# EAGLE board Longboard (EAGLE 9.1.3)
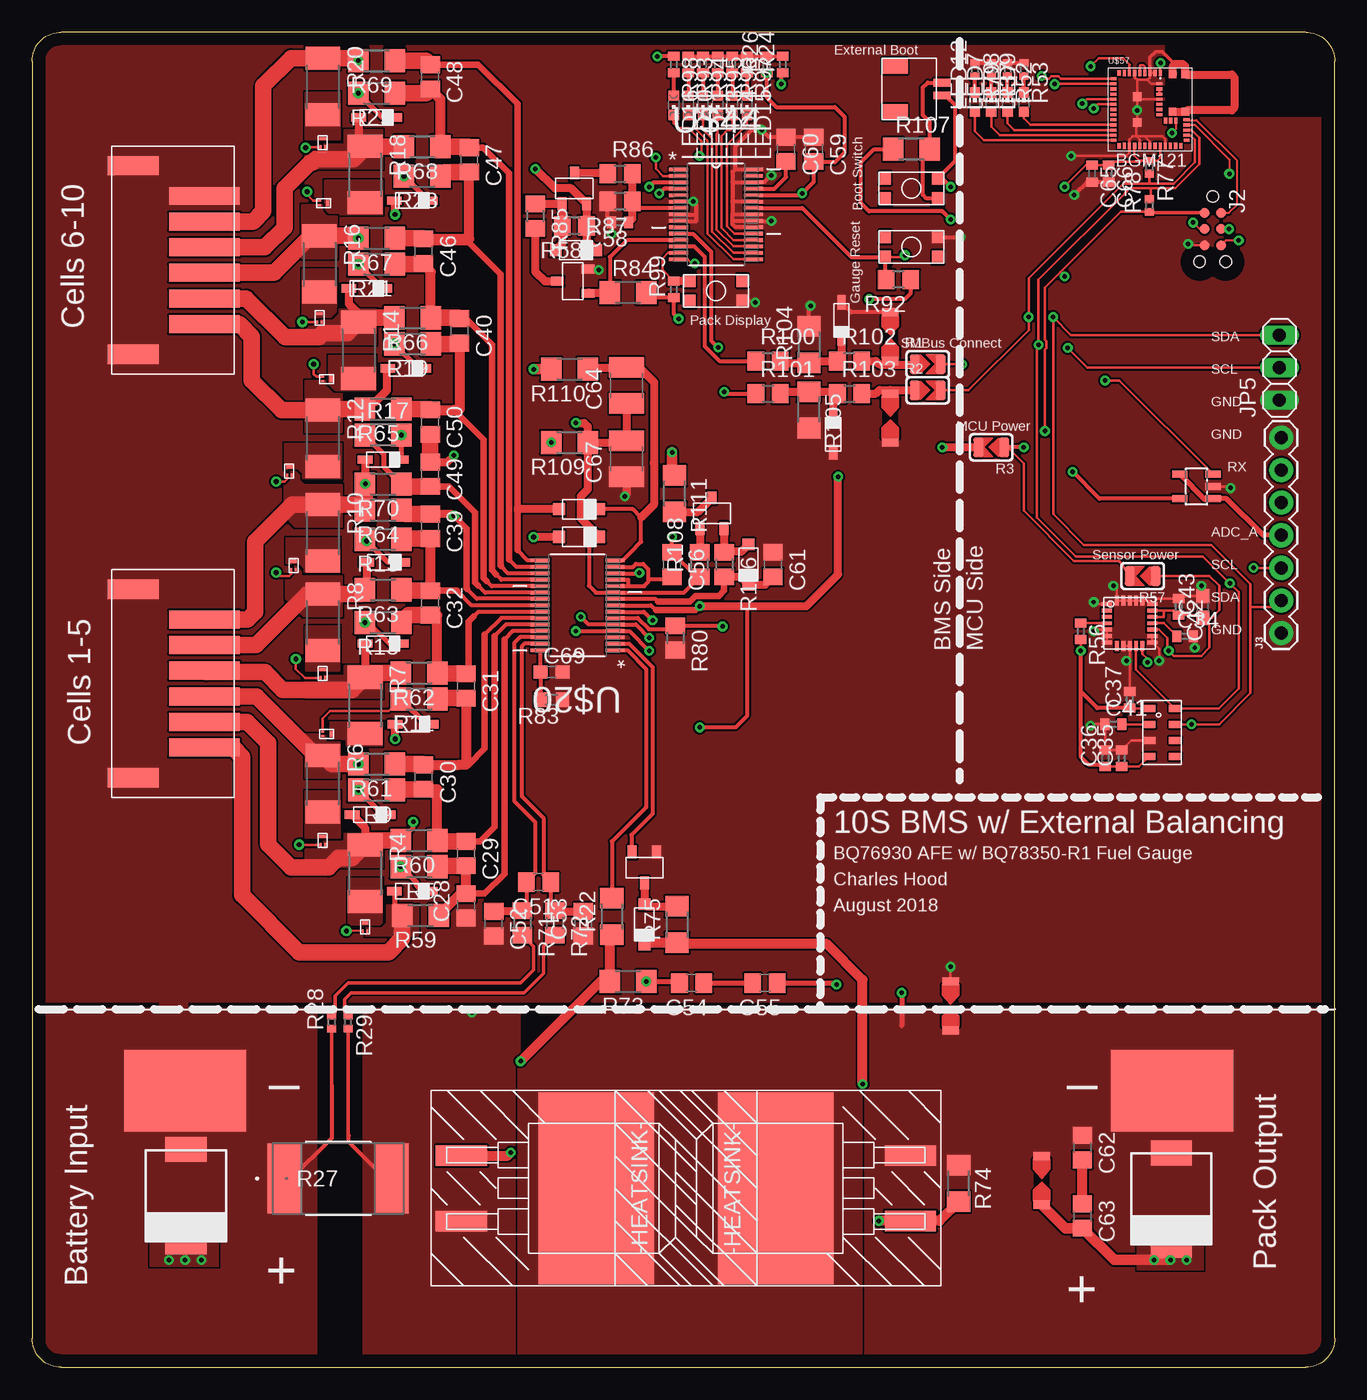
[diagram p4: board, top side]
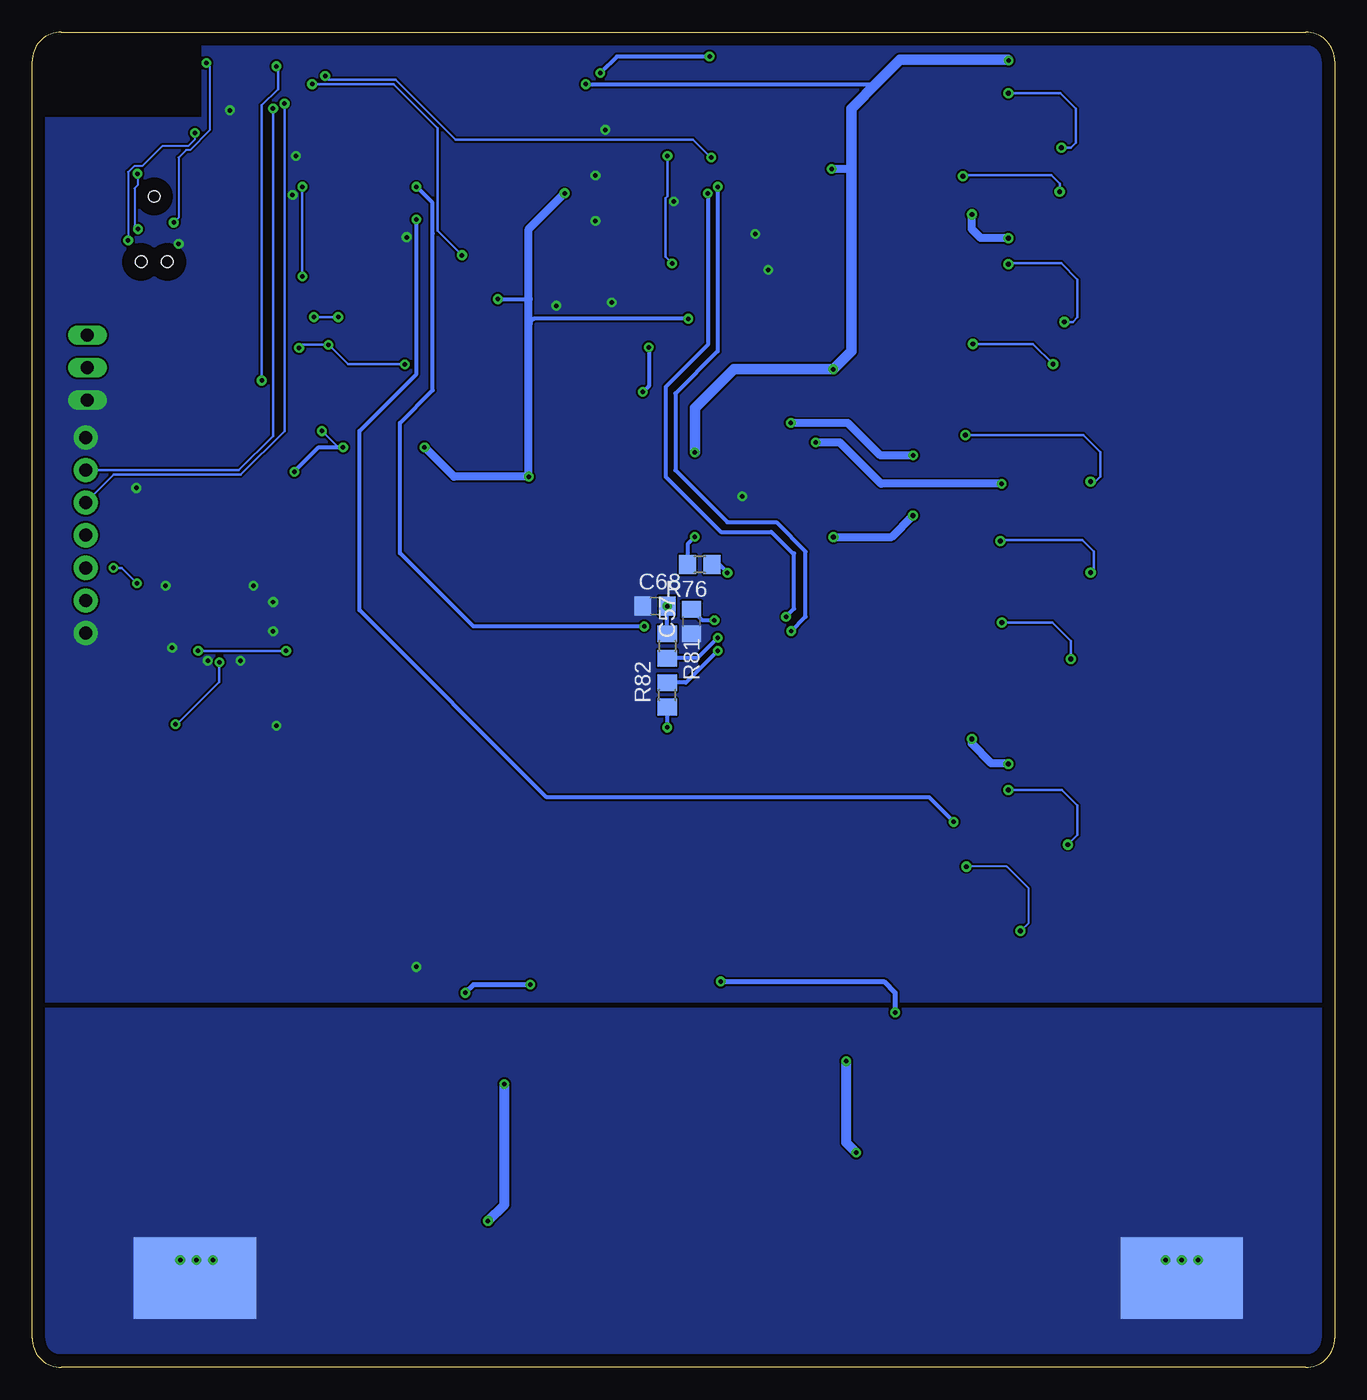
[diagram p5: board, bottom side, seen from below]

Size 101.6 x 104.14 mm. Coordinates in mm from the lower left corner, seen from the top.
Outline: 2.29,0 99.31,0 arc90 101.6,2.29 101.6,101.85 arc90 99.31,104.14 2.29,104.14 arc90 0,101.85 0,2.29 arc90 2.29,0
Copper layers (1*16): Top 0.035mm / dielectric 1.5mm / Bottom 0.035mm
Design rules "default": minimum track width 6mil, minimum drill 0.35mm, track to track 6mil, track to pad 6mil, pad to pad 6mil, via to via 6mil, smd to smd 6mil, copper to edge 40mil, drill to drill 6mil, minimum pad ring 10mil, minimum via ring 8mil, stop-mask expansion 4mil, vias tented up to drill 0mil, thermal gap 10mil
Net classes: 0 default: width 0.152 mm, drill 0.305 mm, clearance 0.152 mm; 1 power: width 0.203 mm, drill 0.305 mm, clearance 0.152 mm
tRestrict: area 88.4,97.5 to 101.6,105.4
bRestrict: area 88.4,97.5 to 102.4,105.2

## Footprints (pad centres in the part's own frame; a part is rotated, then mirrored left to right if it is on the bottom)
C0805 = smd 1.3 x 1.5: 1 -0.95,0; 2 0.95,0
C0402 = smd 0.7 x 0.9: 1 -0.65,0; 2 0.65,0
C0603 = smd 1.1 x 1: 1 -0.85,0; 2 0.85,0
C1210 = smd 1.6 x 2.7: 1 -1.4,0; 2 1.4,0
JST_2PIN_SH = smd 0.6 x 1.35: 1 -0.5,2.135; 2 0.5,2.135 | smd 1.2 x 2: A1 -1.8,-1.54; A2 1.8,-1.54
TC2030-MCP-NL = smd 0.787 x 0.787: 1 1.27,-0.635; 2 1.27,0.635; 3 2.54,-0.635; 4 2.54,0.635; 5 3.81,-0.635; 6 3.81,0.635 | hole 0.889: 0,0; 5.08,-1.016; 5.08,1.016
1X07 = drill 1.016 pad 1.88: 1 0,0; 2 2.54,0; 3 5.08,0; 4 7.62,0; 5 10.16,0; 6 12.7,0; 7 15.24,0
1X03 = drill 1.016 long: 1 -2.54,0; 2 0,0; 3 2.54,0
CHIP-LED0603 = smd 0.8 x 0.8: A 0,-0.75; C 0,0.75
CHIPLED_0603 = smd 0.8 x 0.8: A 0,-0.75; C 0,0.75
3-XFDFN = smd 0.5 x 0.25: P$1 0,0.325 | smd 0.15 x 0.25: P$2 -0.175,-0.325; P$3 0.175,-0.325
SOLDERJUMPER_ARROW_NOPASTE = smd 0.762 x 1.524: 1 -1.016,0; 2 1.016,0
R2010 = smd 1.8 x 2.7: 1 -2.2,0; 2 2.2,0
R1206 = smd 1.6 x 1.803: 1 -1.422,0; 2 1.422,0
R0402 = smd 0.7 x 0.9: 1 -0.65,0; 2 0.65,0
W-3921 = smd 2.642 x 5.461: 1 -4.166,0; 2 4.166,0
R0402' = smd 0.6 x 0.7: 1 -0.5,0; 2 0.5,0
R0805 = smd 1.3 x 1.5: 1 -0.95,0; 2 0.95,0
R0603 = smd 1 x 1.1: 1 -0.85,0; 2 0.85,0
KMR731NG = smd 0.9 x 1: P$1 -2.05,0.8; P$2 2.05,0.8; P$3 2.05,-0.8; P$4 -2.05,-0.8
SOD-323F = smd 0.65 x 1.15: 1 0,1.4; 2 0,-1.4
SOT23-5L = smd 0.55 x 1.2: 1 -0.95,-1.3; 2 0,-1.3; 3 0.95,-1.3; 4 0.95,1.3; 5 -0.95,1.3
PAD = smd 9.525 x 6.35: P$1 0,0
JST_6PIN = smd 1.4 x 5.5: 1 -5,-2.775; 2 -3,-2.775; 3 -1,-2.775; 4 1,-2.775; 5 3,-2.775; 6 5,-2.775 | smd 1.5 x 4: A1 -7.35,2.775; A2 7.35,2.775
SOIC-30 = smd 1.473 x 0.279: 1 -2.921,3.505; 2 -2.921,2.997; 3 -2.921,2.489; 4 -2.921,2.007; 5 -2.921,1.499; 6 -2.921,0.991; 7 -2.921,0.508; 8 -2.921,0; 9 -2.921,-0.508; 10 -2.921,-0.991; 11 -2.921,-1.499; 12 -2.921,-2.007; 13 -2.921,-2.489; 14 -2.921,-2.997; 15 -2.921,-3.505; 16 2.921,-3.505; 17 2.921,-2.997; 18 2.921,-2.489; 19 2.921,-2.007; 20 2.921,-1.499; 21 2.921,-0.991; 22 2.921,-0.508; 23 2.921,0; 24 2.921,0.508; 25 2.921,0.991; 26 2.921,1.499; 27 2.921,2.007; 28 2.921,2.489; 29 2.921,2.997; 30 2.921,3.505
SOD-123 = smd 0.9 x 0.95: P$1 -1.575,0; P$2 1.575,0
TO-263 = smd 1.6 x 4: 1 -2.54,-5.25; 2 2.54,-5.25 | smd 15 x 9: 3 0,5.25
MLP3115A2 = smd 0.95 x 0.55: 1 -1,1.875; 2 -1,0.625; 3 -1,-0.625; 4 -1,-1.875; 5 1,-1.875; 6 1,-0.625; 7 1,0.625; 8 1,1.875
FXAS21002 = smd 0.8 x 0.3: 1 -1.775,1.5; 2 -1.775,1; 3 -1.775,0.5; 4 -1.775,0; 5 -1.775,-0.5; 6 -1.775,-1; 7 -1.775,-1.5; 13 1.775,-1.5; 14 1.775,-1; 15 1.775,-0.5; 16 1.775,0; 17 1.775,0.5; 18 1.775,1; 19 1.775,1.5 | smd 0.3 x 0.8: 8 -1,-1.775; 9 -0.5,-1.775; 10 0,-1.775; 11 0.5,-1.775; 12 1,-1.775; 20 1,1.775; 21 0.5,1.775; 22 0,1.775; 23 -0.5,1.775; 24 -1,1.775
SOT23-3 = smd 0.7 x 1: 1 -0.95,-1.2; 2 0.95,-1.2; 3 0,1.2
SPARK_GAP = smd 1.27 x 0.635: P$1 0,1.905; P$2 0,-1.905
BGM121_PAC = smd 0.245 x 0.5: P$1 3.65,5.7; P$2 3.25,5.7; P$3 2.85,5.7; P$4 2.45,5.7; P$5 2.05,5.7; P$6 1.65,5.7; P$7 1.25,5.7; P$8 0.85,5.7; P$24 0.85,0; P$25 1.25,0; P$26 1.65,0; P$27 2.05,0; P$28 2.45,0; P$29 2.85,0; P$30 3.25,0; P$31 3.65,0; P$32 4.05,0; P$33 4.45,0; P$34 4.85,0 | smd 0.245 x 0.425: P$9 0.45,5.7; P$23 0.45,0; P$35 5.25,0 | smd 0.425 x 0.245: P$10 0,5.25; P$22 0,0.45; P$36 5.7,0.45 | smd 0.5 x 0.245: P$11 0,4.85; P$12 0,4.45; P$13 0,4.05; P$14 0,3.65; P$15 0,3.25; P$16 0,2.85; P$17 0,2.45; P$18 0,2.05; P$19 0,1.65; P$20 0,1.25; P$21 0,0.85; P$37 5.7,0.85; P$38 5.7,1.25; P$39 5.7,1.65; P$40 5.7,2.05; P$45 3.585,2.85; P$46 3.585,3.25; P$47 3.585,3.65; P$48 3.585,4.05; P$49 3.585,4.45; P$50 3.585,4.85 | smd 0.245 x 0.45: P$41 4.865,1.98; P$42 4.465,1.98; P$43 4.065,1.98 | smd 0.45 x 0.245: P$44 3.585,2.45 | smd 0.67 x 0.67: P$51 1.85,3.85; P$52 1.85,1.85 | smd 0.6 x 0.6: P$53 5.615,5.6; P$54 4.615,5.6; P$55 4.615,2.68; P$56 5.615,2.68
SMC(DO-214AB) = smd 1.96 x 3.2: 1 -3.6,0; 2 3.6,0

## Placement (x,y rotation side)
C28  0.22uF  [C0805]  33.85,36 90 top
C29  0.22uF  [C0805]  33.85,40.07 270 top
C30  0.22uF  [C0805]  30.54,46.04 270 top
C31  0.22uF  [C0805]  33.85,53.15 270 top
C32  0.22uF  [C0805]  31.05,59.63 270 top
C34  0.1uF  [C0402]  89.92,57.02 0 top
C35  1uF  [C0402]  84.96,47.5 90 top
C36  100nF  [C0402]  83.69,47.5 90 top
C37  0.1uF  [C0402]  85.6,52.07 90 top
C39  0.22uF  [C0805]  31.05,65.6 270 top
C40  0.22uF  [C0805]  33.34,80.84 270 top
C41  1uF  [C0402]  84.33,50.16 0 top
C42  1uF  [C0402]  89.41,59.31 270 top
C43  10uF  [C0603]  91.31,59.31 90 top
C46  0.22uF  [C0805]  30.54,87.06 270 top
C47  0.22uF  [C0805]  34.1,94.17 270 top
C48  0.22uF  [C0805]  31.05,100.65 270 top
C49  0.22uF  [C0805]  31.05,69.66 270 top
C50  0.22uF  [C0805]  31.05,73.72 270 top
C51  0.1uF  [C0805]  39.5,37.85 180 top
C52  0.1uF  [C0805]  36,34.61 270 top
C53  0.1uF  [C0805]  42.99,34.61 90 top
C54  0.1uF  [C0805]  51.44,29.97 180 top
C55  0.1uF  [C0805]  57.15,29.97 180 top
C56  1uF  [C0805]  49.91,62.61 270 top
C57  1uF  [C0805]  50.16,58.17 90 bottom
C58  3300pF  [C0402]  45.85,89.28 180 top
C59  0.1uF  [C0805]  60.96,95 270 top
C60  0.1uF  [C0805]  58.8,95 270 top
C61  1uF  [C0805]  57.79,62.61 270 top
C62  0.1uF  [C0805]  81.91,17.14 270 top
C63  0.1uF  [C0805]  81.91,11.81 270 top
C64  10uF  [C1210]  46.36,76.58 90 top
C65  1uF  [C0402]  82.68,93.09 270 top
C66  0.1uF  [C0402]  83.95,93.09 270 top
C67  10uF  [C1210]  46.36,70.87 90 top
C68  4.7uF  [C0805]  53.02,59.37 0 bottom
C69  500pF  [C0603]  40.51,54.23 0 top
J1  JST_2PIN_SH  [JST_2PIN_SH]  68.83,99.7 270 top
J2  [TC2030-MCP-NL]  92.07,91.31 270 top
J3  [1X07]  97.41,57.28 90 top
JP5  [1X03]  97.28,77.98 90 top
LED7  [CHIP-LED0603]  74.8,98.68 0 top
LED8  [CHIP-LED0603]  76.07,98.68 0 top
LED9  [CHIP-LED0603]  77.34,98.68 0 top
LED10  [CHIPLED_0603]  51.18,98.43 180 top
LED11  [CHIPLED_0603]  52.32,98.43 180 top
LED12  [CHIP-LED0603]  73.53,98.68 0 top
LED13  [CHIPLED_0603]  53.47,98.43 180 top
LED14  [CHIPLED_0603]  54.61,98.43 180 top
LED15  [CHIPLED_0603]  55.75,98.43 180 top
LED16  [CHIPLED_0603]  50.04,98.43 180 top
Q1  CSD13381F4  [3-XFDFN]  25.97,34.35 0 top
Q3  CSD13381F4  [3-XFDFN]  22.67,41.08 0 top
Q4  CSD13381F4  [3-XFDFN]  22.99,49.4 270 top
Q5  CSD13381F4  [3-XFDFN]  22.67,54.1 0 top
Q6  CSD13381F4  [3-XFDFN]  20.38,62.55 0 top
Q7  CSD13381F4  [3-XFDFN]  20.07,69.91 0 top
Q8  CSD13381F4  [3-XFDFN]  22.99,77.09 270 top
Q9  CSD13381F4  [3-XFDFN]  22.42,81.85 0 top
Q10  CSD13381F4  [3-XFDFN]  22.73,90.81 270 top
Q11  CSD13381F4  [3-XFDFN]  22.67,95.5 0 top
R1  dnp  [SOLDERJUMPER_ARROW_NOPASTE]  69.85,78.23 0 top
R2  dnp  [SOLDERJUMPER_ARROW_NOPASTE]  69.85,76.2 0 top
R3  dnp  [SOLDERJUMPER_ARROW_NOPASTE]  74.8,71.76 180 top
R4  28.7  [R2010]  25.97,38.54 270 top
R5  10k  [R1206]  30.17,39.05 180 top
R6  28.7  [R2010]  22.67,45.53 270 top
R7  28.7  [R2010]  25.97,51.63 270 top
R8  28.7  [R2010]  22.67,58.1 270 top
R9  10k  [R1206]  26.87,45.02 180 top
R10  28.7  [R2010]  22.67,65.09 270 top
R11  10k  [R1206]  30.17,52.13 180 top
R12  28.7  [R2010]  22.67,72.45 270 top
R13  10k  [R1206]  27.38,58.1 180 top
R14  28.7  [R2010]  25.46,79.31 270 top
R15  10k  [R1206]  27.38,64.58 180 top
R16  28.7  [R2010]  22.42,86.04 270 top
R17  10k  [R1206]  27.38,72.71 0 top
R18  28.7  [R2010]  25.97,93.03 270 top
R19  10k  [R1206]  29.66,79.82 180 top
R20  28.7  [R2010]  22.67,99.89 270 top
R21  10k  [R1206]  26.87,86.04 180 top
R22  0  [R1206]  45.21,35.18 90 top
R23  10k  [R1206]  30.42,92.9 180 top
R24  dnp  [R0402]  58.55,101.6 90 top
R25  10k  [R1206]  26.87,99.38 180 top
R26  dnp  [R0402]  57.28,101.6 90 top
R27  WSLP39211L000FEB  [W-3921]  23.88,14.73 0 top
R28  0  [R0402']  23.37,26.92 90 top
R29  0  [R0402']  24.64,26.92 270 top
R37  330  [R0402']  74.8,101.22 270 top
R52  330  [R0402']  76.07,101.22 270 top
R53  330  [R0402']  77.34,101.22 270 top
R56  47k  [R0402]  81.79,57.4 270 top
R57  dnp  [SOLDERJUMPER_ARROW_NOPASTE]  86.61,61.72 180 top
R58  100k  [R0805]  42.29,89.03 180 top
R59  1k  [R1206]  30.3,35.24 180 top
R60  1k  [R1206]  30.17,41.08 180 top
R61  1k  [R1206]  26.87,47.05 180 top
R62  1k  [R1206]  30.17,54.17 180 top
R63  1k  [R1206]  27.38,60.64 180 top
R64  1k  [R1206]  27.38,66.87 180 top
R65  1k  [R1206]  27.38,74.74 180 top
R66  1k  [R1206]  29.66,81.85 180 top
R67  1k  [R1206]  26.87,88.07 180 top
R68  1k  [R1206]  30.42,95.19 180 top
R69  1k  [R1206]  26.87,101.92 180 top
R70  1k  [R1206]  27.38,68.9 180 top
R71  100  [R0805]  38.23,34.67 270 top
R72  100  [R0805]  40.77,34.67 270 top
R73  1M  [R1206]  46.48,30.1 180 top
R74  1M  [R1206]  72.26,14.35 270 top
R75  1M  [R1206]  50.29,34.54 90 top
R76  10k  [R0805]  49.53,62.61 180 bottom
R77  4.7k  [R0402']  87.12,93.6 270 top
R78  4.7k  [R0402']  87.12,90.61 90 top
R79  330  [R0402']  73.53,101.22 270 top
R80  10k  [R0805]  50.16,56.9 270 top
R81  10k  [R0805]  52.07,56.26 270 bottom
R82  10k  [R0805]  52.07,52.45 90 bottom
R83  499k  [R0603]  40.51,52.07 180 top
R84  1M  [R1206]  46.48,83.82 0 top
R85  100k  [R0805]  39.24,89.79 270 top
R86  300k  [R0805]  45.85,93.09 0 top
R87  13.7k  [R0805]  45.85,90.93 180 top
R92  100k  [R0805]  67.56,84.84 180 top
R93  330  [R0402]  51.18,101.6 270 top
R94  330  [R0402]  52.32,101.6 270 top
R95  330  [R0402]  53.47,101.6 270 top
R96  330  [R0402]  54.61,101.6 270 top
R97  330  [R0402]  55.75,101.6 270 top
R98  330  [R0402]  50.04,101.6 270 top
R99  100k  [R0402]  50.04,84.07 90 top
R100  100  [R0805]  57.4,78.49 0 top
R101  100  [R0805]  57.4,75.95 0 top
R102  100  [R0805]  63.75,78.49 0 top
R103  100  [R0805]  63.75,75.95 0 top
R104  1M  [R1206]  60.58,79.76 90 top
R105  1M  [R1206]  60.58,74.68 270 top
R106  100k  [R0805]  53.98,62.61 270 top
R107  3.01k  [R1206]  68.58,95 0 top
R108  100k  [R0805]  52.07,62.61 90 top
R109  1k  [R1206]  41.91,72.14 180 top
R110  1k  [R1206]  41.91,77.85 180 top
R111  200  [R1206]  50.1,68.14 270 top
S1  KMR731NG  [KMR731NG]  68.58,91.95 0 top
S2  KMR731NG  [KMR731NG]  53.34,83.95 0 top
S3  KMR731NG  [KMR731NG]  68.58,87.38 0 top
U$3  MMSZ5232BS-7-F  [SOD-323F]  26.36,43.12 90 top
U$4  MMSZ5232BS-7-F  [SOD-323F]  29.72,50.16 90 top
U$5  MCP6001  [SOT23-5L]  90.8,68.71 90 top
U$6  MMSZ5232BS-7-F  [SOD-323F]  29.66,37.15 90 top
U$7  MMSZ5232BS-7-F  [SOD-323F]  27.38,56.45 90 top
U$8  MMSZ5232BS-7-F  [SOD-323F]  27.49,62.8 90 top
U$9  MMSZ5232BS-7-F  [SOD-323F]  27.38,70.8 90 top
U$10  MMSZ5232BS-7-F  [SOD-323F]  29.15,77.91 90 top
U$11  MMSZ5232BS-7-F  [SOD-323F]  26.11,84.14 90 top
U$12  MMSZ5232BS-7-F  [SOD-323F]  29.66,91 90 top
U$13  MMSZ5232BS-7-F  [SOD-323F]  26.87,97.47 90 top
U$14  PAD  [PAD]  88.9,21.59 180 top
U$15  PAD  [PAD]  88.9,6.99 0 bottom
U$16  PAD  [PAD]  11.94,6.99 0 bottom
U$17  PAD  [PAD]  11.94,21.59 0 top
U$18  JST_6PIN  [JST_6PIN]  10.67,86.36 90 top
U$19  JST_6PIN  [JST_6PIN]  10.67,53.34 90 top
U$20  BQ76930  [SOIC-30]  42.55,59.44 180 top
U$21  1N4148W-7-F  [SOD-123]  42.67,64.77 0 top
U$22  AOB290L  [TO-263]  38.73,13.97 270 top
U$23  AOB290L  [TO-263]  63.25,13.97 90 top
U$25  MLP3115A2  [MLP3115A2]  88.14,49.53 0 top
U$34  FXAS21002  [FXAS21002]  85.6,58.04 0 top
U$40  1N4148W-7-F  [SOD-123]  47.75,34.54 270 top
U$41  NTR5105PT1G  [SOT23-3]  47.75,38.99 180 top
U$43  1N4148W-7-F  [SOD-123]  42.67,66.93 0 top
U$44  BQ78350-R1  [SOIC-30]  53.34,89.92 0 top
U$45  NTR5105PT1G  [SOT23-3]  42.29,91.95 0 top
U$46  BSS138  [SOT23-3]  42.16,84.71 90 top
U$47  MMSZ5246B-7-F  [SOD-123]  42.42,87.12 0 top
U$50  MMSZ5232BS-7-F  [SOD-323F]  63.12,81.66 0 top
U$51  MMSZ5232BS-7-F  [SOD-323F]  62.48,72.77 180 top
U$52  SPARK_GAP  [SPARK_GAP]  66.93,74.04 180 top
U$53  SPARK_GAP  [SPARK_GAP]  66.93,80.39 0 top
U$54  BST82  [SOT23-3]  53.02,66.61 0 top
U$55  1N4148W-7-F  [SOD-123]  55.88,62.61 270 top
U$56  SPARK_GAP  [SPARK_GAP]  78.74,14.61 180 top
U$57  BGM121_DEV  [BGM121_PAC]  84.33,95.25 0 top
U$58  MURS360T3G  [SMC(DO-214AB)]  88.84,13.14 270 top
U$59  SPARK_GAP  [SPARK_GAP]  71.63,28.19 180 top
U$60  SMCJ75A  [SMC(DO-214AB)]  12,13.4 270 top

## Tracks (layer width: path | path; a pad name or v marks a point on that pad's centre or on a via)
+3V3  (via drill 0.35)
  Top 0.203: U$57.P$31 87.98,94.33 87.75,94.1 R77.1 86.37,94.1 | U$57.P$26 85.98,94.49 86.37,94.1 | 86.37,94.1 86.42,94.04 84.25,94.04 C66.1 C65.1 82.18,93.74 v80.52,92.08 | R57.2 84.8,62.89 81.26,62.89 77.34,66.81 77.34,70.48 76.07,71.76 | R78.1 84.91,90.12 80.2,85.41 | v78.99,73.03 78.99,79.37 79.12,79.49 79.12,80.02 78.99,80.15 78.99,84.2 80.2,85.41 | v80.52,85.09 80.2,85.41
  Top 0.254: J2.1 87.19,90.04 R78.1
  Top 0.305: R3.1 76.07,71.76 v77.34,71.76 | U$5.5 83.25,67.76 v81.15,69.85
  Bottom 0.203: v78.99,73.03 77.72,71.76 v77.34,71.76 | v80.52,92.08 v80.52,85.09
  Bottom 0.305: v81.15,69.85 79.25,71.76 v77.34,71.76
+3V3_SENSOR  (via drill 0.35)
  Top 0.203: U$25.4 86.33,46.85 C35.1 C36.1 | U$25.1 85.61,51.41 C37.1 | U$34.18 88.27,59.04 | 88.27,59.04 89.03,59.04 C42.2 91.11,58.66 C43.1 | U$34.17 88.26,58.54 88.27,58.55 88.27,59.04 | U$34.15 87.88,57.54 88.52,56.9 88.52,56.01 v88.65,55.88 89.03,55.5 91.19,55.5 91.82,56.13 91.82,57.95 C43.1 | R56.2 v81.79,55.88 | C43.1 91.99,58.46 92.58,59.05 92.58,60.96 91.82,61.72 R57.1
  Top 0.305: C37.1 83.07,51.42 81.79,52.7 | 81.79,52.7 v81.79,55.88 | C36.1 83.55,46.99 82.42,46.99 81.79,47.62 81.79,52.7
  Bottom 0.203: v81.79,55.88 v88.65,55.88
ALERT
  Top 0.305: U$20.30 39.62,54.27 C69.1 R83.2
BOOT  (via drill 0.35)
  Top 0.305: S1.P$2 70.79,92.91 | 70.79,92.91 72.01,94.13 72.01,98.43 71.24,99.2 J1.2 | U$20.6 47.23,58.45 48.1,57.58 49.9,57.58 50.1,57.78 50.13,57.82 R80.1 53.79,57.85 v53.85,57.78 | v71.63,92.08 70.79,92.91
  Bottom 0.305: v53.85,57.78 67.18,57.78 72.9,63.5 72.9,73.66 70.36,76.2 70.36,88.45 70.38,88.48 70.38,90.83 v71.63,92.08
CELL0
  Top 0.406: U$6.1 28.26,35.86 R59.2
  Top 1.27: U$19.1 15.67,48.34 16.38,47.62 16.38,36.83 20.83,32.38 27.81,32.38 28.88,33.45 R59.2
  pour Top (no thermals): 26.04,34.29 27.3,34.29 27.69,34.67 27.69,36.07 30.1,36.07 30.1,33.66 26.04,33.66
CELL1  (via drill 0.35)
  Top 0.305: R60.2 29.72,42.05 v29.72,42.55 | v71.63,89.54 70.99,90.17 65.28,90.17 64.64,90.81 64.64,93.98 65.66,95 R107.1
  Top 0.61: U$3.1 25.97,42.1 R4.1
  Top 1.27: R60.2 26.31,41.08 R4.1 24.98,39.75 23.88,39.75 23.11,38.99 20.19,38.99 18.41,40.77 18.41,48.69 16.77,50.34 U$19.2
  Bottom 0.305: v29.72,42.55 31.62,44.45 61.47,44.45 76.07,59.05 76.07,73.03 71.63,77.47 v71.63,89.54
  pour Top (no thermals): 21.34,41.02 24.26,41.02 24.38,41.15 24.38,41.66 27.3,41.66 27.3,38.99 21.34,38.99
CELL2  (via drill 0.38)
  Top 0.61: v28.32,49.02 U$4.1
  Top 1.27: R61.2 23.35,47.05 R6.1 22.12,47.73 17.51,52.34 U$19.3
  Bottom 0.61: R61.2 25.51,47.12 26.8,47.12 28.32,48.64 v28.32,49.02
  other vias: 25.45,47.05
  pour Top (no thermals): 22.86,49.4 22.86,48.89 22.99,48.77 24,48.77 24,45.97 21.34,45.97 21.34,49.4
CELL3
  Top 0.61: U$7.1 R7.1
  Top 1.27: R62.2 26.31,54.17 R7.1 24.98,52.83 19.56,52.83 18.16,54.23 13.55,54.23 U$19.4
  pour Top (no thermals): 21.34,53.98 24.38,53.98 24.38,54.74 27.3,54.74 27.3,52.2 21.34,52.2
CELL4
  Top 0.61: U$8.1 26.09,60.78 R63.2
  Top 1.27: R63.2 25.61,60.3 R8.1 21.44,60.3 17.48,56.34 U$19.5
  pour Top (no thermals): 19.81,62.48 20.57,62.48 20.96,62.1 20.96,61.85 21.08,61.72 24.13,61.72 24.13,58.55 21.21,58.55 19.81,59.94
CELL5  (via drill 0.35)
  Top 0.61: U$9.1 v25.98,68.92 R70.2
  Top 1.27: R70.2 R64.2 25.53,67.29 R10.1 20.3,67.29 17.4,64.39 17.4,58.93 16.81,58.34 U$19.6
  Bottom 0.61: v25.98,68.92 35.39,68.92 38.61,72.14 R109.2
  other vias: 40.49,72.14
  pour Top (no thermals): 19.68,69.85 20.57,69.85 20.83,69.6 20.83,69.22 21.08,68.96 21.21,68.83 24.13,68.83 24.13,65.53 20.57,65.53 19.68,66.42
CELL6
  Top 0.61: R65.2 26.53,75.31 26.8,75.31 27.69,76.2 27.69,77.85 U$10.1
  Top 1.27: R65.2 22.76,74.74 R12.1 19.45,74.65 17.14,76.96 17.14,80.39 16.18,81.36 U$18.1
  pour Top (no thermals): 22.86,76.96 22.86,76.58 23.5,75.95 24.13,75.95 24.13,72.9 21.34,72.9 21.34,76.96
CELL7
  Top 0.61: U$11.1 24.71,82.95 25.8,81.85
  Top 1.27: R66.2 25.8,81.85 | 25.8,81.85 R14.1 | U$18.2 16.72,83.36 19.72,80.35 22.38,80.35 22.67,80.65 24.6,80.65 25.8,81.85
  pour Top (no thermals): 21.08,81.66 23.5,81.66 24,82.17 24,82.55 26.8,82.55 26.8,79.76 21.08,79.76
CELL8  (via drill 0.38)
  Top 0.61: v28.32,89.92 28.32,90.94 U$12.1
  Top 1.27: R67.2 25.28,88.24 R16.1 21.78,88.24 18.9,85.36 U$18.3
  Bottom 0.61: R67.2 27.62,88.07 28.32,88.77 v28.32,89.92
  other vias: 25.45,88.07
  pour Top (no thermals): 21.08,90.68 22.61,90.68 22.61,90.17 22.99,89.79 23.75,89.79 23.75,86.49 21.08,86.49
CELL9
  Top 0.61: U$13.1 25.47,95.73 26.01,95.19
  Top 1.27: R18.1 26.01,95.19 | 26.01,95.19 R68.2 | U$18.4 18.14,87.36 19.68,88.9 19.68,91.95 21.68,93.94 21.82,93.94 22.12,94.23 25.06,94.23 26.01,95.19
  pour Top (no thermals): 21.34,95.38 24.38,95.38 24.38,96.52 27.3,96.52 27.3,93.47 21.34,93.47
CELL10  (via drill 0.35)
  Top 0.305: R24.1 58.42,100.82 v58.42,100.08
  Top 0.61: U$47.P$2 43.24,87.87 R58.1 U$45.2 42.04,91.95 40.77,91.95 v39.24,93.47
  Top 0.813: R110.2 v39.12,77.85 | v49.91,71.37 49.91,69.75 R111.1
  Top 1.27: R69.2 25.28,102.09 R20.1 20.21,102.09 20.19,102.11 18.03,99.95 18.03,90.17 17.22,89.36 U$18.5
  Bottom 0.305: v58.42,100.08 35.81,100.08 35.56,100.33
  Bottom 0.61: 25.51,101.98 R69.2 | v39.24,93.47 37.72,93.47
  Bottom 0.813: 25.51,101.98 33.91,101.98 35.56,100.33 37.72,98.17 37.72,93.47 37.72,79.25 v39.12,77.85 46.86,77.85 49.91,74.8 v49.91,71.37
  other vias: 25.45,101.92
DBG_RESET  (via drill 0.35)
  Top 0.152: U$57.P$1 87.98,101.69 v88.01,101.73 | v90.55,89.28 91.06,88.77 J2.3
  Bottom 0.152: v88.01,101.73 87.76,101.47 87.76,96.47 89.28,94.95 89.59,94.95 90.17,94.36 90.17,89.66 v90.55,89.28
DBG_TCK_SWCLK  (via drill 0.35)
  Top 0.152: U$57.P$39 90.68,96.9 93.37,94.21 v93.37,93.09 | v93.34,88.77 J2.4
  Bottom 0.152: v93.37,93.09 93.37,92.19 93.61,91.95 93.61,89.04 v93.34,88.77
DBG_TDI_SWDIO
  Top 0.152: U$57.P$40 90.05,97.28 90.8,97.28 93.98,94.11 93.98,90.68 93.34,90.04 J2.2
DBG_TDI_SWO  (via drill 0.35)
  Top 0.152: U$57.P$41 89.19,96.56 v88.9,96.27 | v94.11,87.88 93.09,87.88 92.98,87.77 92.71,87.77
  Top 0.203: J2.6 92.71,87.77
  Bottom 0.152: v88.9,96.27 88.9,95.76 89.41,95.25 91.44,95.25 92.99,93.7 93.62,93.7 94.11,93.22 v94.11,87.88
GAUGE_IRQ  (via drill 0.35)
  Top 0.203: v78.74,100.71 78.95,100.5 79.29,100.5 79.49,100.71 80.02,100.71 80.23,100.5 U$57.P$10 | v48.64,94.36 48.64,93.47 49.2,92.91 U$44.2
  Bottom 0.203: v78.74,100.71 78.46,100.43 73.26,100.43 68.58,95.76 50.04,95.76 v48.64,94.36
GAUGE_RESET  (via drill 0.35)
  Top 0.203: S3.P$4 67.91,86.58 v68.07,86.74 | v79.76,100.08 79.78,100.1 U$57.P$11
  Top 0.305: U$44.24 60.07,90.42 63.92,86.58 S3.P$4 66.53,84.92 R92.2
  Bottom 0.203: v68.07,86.74 69.98,88.65 69.98,96.65 73.41,100.08 v79.76,100.08
GAUGE_SCL  (via drill 0.35)
  Top 0.305: v48.13,56.9 47.09,57.94 U$20.5 43.41,57.94 v42.8,58.55 | U$44.4 49.27,91.92 v48.9,91.56
  Bottom 0.305: v48.13,56.9 49.72,55.31 R81.2 | v48.9,91.56 48.9,79.75 52.2,76.45 52.2,69.47 47.88,65.15 43.94,65.15 42.29,63.5 42.16,63.5 42.16,59.18 v42.8,58.55
GAUGE_SDA  (via drill 0.35)
  Top 0.305: v48.13,55.88 46.58,57.43 U$20.4 v42.39,57.43 | U$44.3 48.46,92.41 v48.13,92.08
  Bottom 0.305: v48.13,55.88 50.61,53.4 R82.2 | v48.13,92.08 48.13,79.25 51.44,75.95 51.44,69.98 47.37,65.91 43.56,65.91 41.27,63.63 41.27,58.55 42.42,57.4 v42.39,57.43
GND  (via drill 0.35)
  Top 0.203: v81.03,94.49 85.34,94.49 85.58,94.72 U$57.P$25 85.58,95.74 85.85,96.01 86.11,96.01 | U$57.P$27 86.38,95.74 86.11,96.01 | 86.11,96.01 86.11,97.03 U$57.P$52 v86.18,98.04 | U$57.P$29 87.15,95.27 87.15,95.61 86.75,96.01 | 86.75,96.01 86.11,96.01 | U$57.P$32 88.38,95.77 88.14,96.01 86.75,96.01 | U$57.P$51 86.18,99.06 | 86.18,99.06 v86.18,98.04 | U$57.P$6 86,100.93 86,100.6 86.18,100.42 | 86.18,100.42 U$57.P$51 | 86.98,100.42 87.15,100.6 87.15,100.93 U$57.P$3 U$57.P$2 | 86.98,100.42 86.18,100.42 | U$57.P$50 87.3,100.1 86.98,100.42 | U$57.P$47 86.34,98.9 86.18,99.06 | J2.5 90.3,87.5 v90.17,87.63 | U$57.P$51 v86.18,98.04 | U$5.2 93.34,68.71 v93.47,68.58 | U$34.1 82.95,59.54 v82.8,59.69 | v84.33,60.96 84.58,60.71 84.58,59.83 U$34.24 U$34.23 U$34.22 U$34.21 U$34.20 87.1,59.81 U$34.19 87.79,59.96 C42.1 89.61,60.16 C43.2 91.31,60.83 v91.19,60.96 | U$34.14 U$34.13 87.9,56.01 v87.9,55.12 | U$34.9 U$34.10 85.6,55.37 v85.34,55.12 85.6,54.86 C37.2 | U$34.7 U$34.6 U$34.5 82.94,57.54 v82.8,57.4 | C34.2 90.68,56.91 v90.68,56.13 | U$25.3 85.72,48.91 C35.2 C36.2 83.69,50.15 C41.1 82.68,50.16 v82.55,50.04 | U$59.P$2 v71.63,31.24
  Top 0.254: R28.1 23.37,21.97 | U$57.P$3 87.18,102.16 87.63,102.62 88.14,102.62 88.97,101.78 88.97,101.48
  Top 0.305: R53.1 R52.1 R37.1 R79.1 | 23.37,21.97 23.37,17.88 20.22,14.73 R27.1 | U$44.6 51.54,90.91 v51.56,90.93 51.82,90.68 51.82,89.92 | U$44.9 51.82,89.41 51.82,89.92 | U$44.8 51.82,89.92 | U$44.21 54.84,88.93 54.61,89.15 54.61,89.41 | 54.61,89.41 54.61,89.92 | 54.61,90.93 54.61,89.92 | 54.61,89.41 U$44.22 v57.66,89.41 | U$44.23 54.61,89.92 | U$44.25 54.63,90.91 54.61,90.93 | 54.61,92.46 54.61,90.93 | 54.61,92.46 54.66,92.41 U$44.28 56.32,92.47 57.12,92.47 57.62,92.96 v57.66,92.96 | U$44.30 54.86,93.42 | 54.86,93.42 54.81,93.42 54.61,93.22 54.61,92.46 | C59.1 C60.1 57.47,95.95 v56.9,96.52 56.13,96.52 54.86,95.25 54.86,93.42 | R87.2 44.9,89.58 C58.2 45.21,89.27 v45.21,88.39 | U$46.2 44.13,85.66 v44.2,85.6 | S2.P$3 56.3,83.15 v56.39,83.06 | R104.2 60.58,82.68 v60.71,82.8 | U$53.P$1 63.88,82.3 U$50.1 | S3.P$2 70.67,88.14 v72.39,88.14 | C66.2 C65.2 82.28,92.44 v81.28,91.44
  Top 0.61: C67.1 46.36,68.07 v46.23,67.95 | U$57.P$54 88.97,100.88 88.97,101.48 89.15,101.66 89.73,101.66 89.91,101.48 89.91,100.88 U$57.P$53 89.97,100.82 93.57,100.82 93.75,100.64 93.75,98.22 93.57,98.04 90.06,98.04 U$57.P$56 U$57.P$55
  Bottom 0.203: v87.9,55.12 87.88,55.12
  Bottom 0.305: v51.56,90.93
  pour Top (rank 3, no thermals): -3.3,-1.91 22.1,-1.91 22.1,27.94 12.07,27.94 12.07,28.57 102.74,28.57 102.74,105.41 -3.3,105.41 -3.3,28.57 10.03,28.57 10.03,27.94 -3.3,27.94
  pour Bottom (rank 3, no thermals): -2.67,104.65 102.74,104.65 102.74,28.57 -2.67,28.57
MCU_DAC_OUT  (via drill 0.35)
  Top 0.203: U$5.3 84.8,76.96 v83.69,76.96 | v82.55,101.47 83.18,102.11 85.09,102.11 85.6,101.6 85.58,101.58 U$57.P$7
  Bottom 0.203: v83.69,76.96 83.69,98.43 82.42,99.7 82.42,101.35 v82.55,101.47
N$1
  Top 0.203: U$57.P$22 74.23,95.7 73.53,96.39 LED12.A
N$2
  Top 0.203: U$57.P$21 75.48,96.1 74.8,96.77 LED7.A
N$3
  Top 0.203: U$57.P$20 76.6,96.5 76.07,97.03 LED8.A
N$4
  Top 0.203: U$57.P$19 77.85,96.9 77.34,97.41 LED9.A
N$5
  Top 0.254: R71.2 39.12,32.83 39.12,30.99 38.1,29.97 24.64,29.97 23.62,28.96 23.62,27.68 R28.2
N$6
  Top 0.254: R72.2 39.88,32.83 39.88,30.73 38.35,29.21 24.89,29.21 24.38,28.7 24.38,27.68 R29.1
N$7
  pour Top (rank 2, no thermals): 24.64,35.56 24.64,34.54 27.3,34.54 27.3,38.1 24.64,38.1
N$8  (via drill 0.38)
  Top 0.203: Q8.P$2 22.18,77.26 21.97,77.47 v21.97,78.23
  Top 0.406: R19.2 30.14,77.91 U$10.2
  Bottom 0.203: v21.97,78.23 23.56,79.82 R19.2
  other vias: 28.24,79.82
N$9  (via drill 0.38)
  Top 0.152: Q1.P$2 24.52,34.03 v24.51,34.04
  Top 0.406: R5.2 29.97,37.83 29.97,37.59 30.42,37.15 U$6.2
  Bottom 0.152: v24.51,34.04 23.88,34.67 23.88,37.34 25.59,39.05 R5.2
  other vias: 28.75,39.05
N$10
  pour Top (rank 2, no thermals): 21.34,44.96 24,44.96 24,41.27 21.34,41.27
N$11  (via drill 0.38)
  Top 0.203: Q3.P$2 v20.84,40.76 v20.83,40.77
  Top 0.406: R9.2 27.35,43.12 U$3.2
  Bottom 0.203: v20.83,40.77 20.07,41.53 20.07,43.81 21.27,45.02 R9.2
  other vias: 25.45,45.02
N$12
  Top 0.305: U$20.1 46.42,55.93 47.88,54.47 47.88,43.69 45.21,41.02 R22.2
N$14
  pour Top (rank 2, no thermals): 21.34,54.36 24,54.36 24,57.78 21.34,57.78
N$15
  pour Top (rank 2, no thermals): 23.24,50.29 23.24,49.02 24.38,49.02 24.51,49.02 24.51,48.51 27.3,48.51 27.3,50.29
N$16
  Top 0.203: Q4.P$2 22.66,50.6 23.24,51.18 27.8,51.18 R11.2
  Top 0.406: R11.2 30.72,50.16 U$4.2
N$17  (via drill 0.38)
  Top 0.203: Q5.P$2 21.28,53.78 20.57,54.48 v20.57,55.24
  Top 0.406: R13.2 26.23,58.1 27.88,56.45 U$7.2
  Bottom 0.203: R13.2 22.04,58.1 20.57,56.64 v20.57,55.24
  other vias: 25.95,58.1
N$18  (via drill 0.38)
  Top 0.203: Q6.P$2 20.21,61.87 20.07,61.72 19.3,61.72 v19.05,61.98
  Top 0.406: R15.2 v26.09,64.44 27.73,62.8 U$8.2
  Bottom 0.203: v19.05,61.98 18.8,62.23 18.8,63.63 19.68,64.52 26.02,64.52 v26.09,64.44
N$19
  pour Top (rank 2, no thermals): 23.11,78.87 23.11,76.2 26.8,76.2 26.8,78.87
N$20
  Top 0.305: U$20.20 35.84,60.94 35.43,61.34
  Top 0.508: 32.89,74.68 35.2,72.37 35.2,61.57 35.43,61.34
  Top 0.762: C50.1 32.89,74.68 33.34,74.68 C40.2
  Top 1.27: R19.1 33.27,79.82 C40.2 | R65.1 30.99,74.74 C50.1
N$21
  Top 0.305: U$20.21 35.33,60.43 34.8,60.96
  Top 0.406: R17.1 27.43,71.23 27.43,70.26 28.99,68.71
  Top 0.508: 34.8,60.96 34.54,61.21 34.54,66.68 32.51,68.71 C49.2
  Top 1.27: C49.2 28.99,68.71 R70.1
N$22
  Top 0.305: R93.1 R94.1 R95.1 R96.1 R97.1 R26.2 R24.2
N$23
  pour Top (rank 2, no thermals): 19.81,62.74 20.83,62.74 21.21,62.36 21.21,62.1 24,62.1 24,63.25 24,64.64 19.81,64.64
N$26
  pour Top (rank 2, no thermals): 19.81,70.1 20.7,70.1 21.08,69.72 21.08,69.34 24.13,69.34 24.13,72.01 19.68,72.01 19.68,70.1
N$27  (via drill 0.38)
  Top 0.203: Q7.P$2 19.89,69.29 19.68,69.09 v19.05,69.09
  Top 0.406: R17.2 28.8,70.82 U$9.2
  Bottom 0.203: v19.05,69.09 18.67,69.09 18.29,69.47 18.29,71.37 19.62,72.71 R17.2
  other vias: 28.8,72.71
N$28
  pour Top (rank 2, no thermals): 21.08,85.6 21.08,81.92 23.75,81.92 23.75,85.6
N$30
  Top 0.203: R56.1 83.81,58.05 U$34.4
N$32
  pour Top (rank 2, no thermals): 22.86,92.58 27.3,92.58 27.3,89.92 22.86,89.92
N$33
  pour Top (no thermals): 21.34,99.44 24,99.44 24,95.76 21.34,95.76
N$34  (via drill 0.38)
  Top 0.203: Q11.P$2 21.39,95.18 v21.34,95.12
  Top 0.406: R25.2 27.35,97.47 U$13.2
  Bottom 0.203: v21.34,95.12 20.57,95.12 20.19,95.5 20.19,98.17 21.4,99.38 R25.2
  other vias: 25.45,99.38
N$35  (via drill 0.38)
  Top 0.203: Q10.P$2 21.92,90.98 21.46,91.44 v21.46,91.69
  Top 0.406: R23.2 30.91,91 U$12.2
  Bottom 0.203: v21.46,91.69 21.46,92.33 22.1,92.96 28.94,92.96 R23.2
  other vias: 29,92.9
N$36
  Top 0.305: LED7.C R37.2
N$37  (via drill 0.38)
  Top 0.203: Q9.P$2 21.09,81.53 v21.08,81.53
  Top 0.406: R21.2 27.35,84.14 U$11.2
  Bottom 0.203: R21.2 25.38,86.11 21.34,86.11 20.07,84.84 20.07,81.92 20.45,81.53 v21.08,81.53
  other vias: 25.45,86.04
N$42
  Top 0.305: LED8.C R52.2
N$74
  Top 0.305: LED9.C R53.2
N$75
  Top 0.305: U$20.26 36.98,57.94 36.07,57.02
  Top 0.508: 33.27,41.02 34.92,41.02 36.07,42.16 36.07,57.02
  Top 0.762: R60.1 31.59,45.09 C30.2
  Top 1.27: C30.2 28.36,45.09 R9.1 | C29.1 33.27,41.02 31.66,41.02 R60.1
N$76
  Top 0.305: U$20.25 36.6,58.45 35.31,57.15
  Top 0.508: 29.72,47.05 29.78,46.99 33.27,46.99 34.04,46.99 35.31,48.26 35.31,57.15
  Top 0.762: C30.1 33.27,46.99 33.85,46.99 C31.2
  Top 1.27: C30.1 30.48,47.05 29.72,47.05 R61.1 | C31.2 31.66,52.2 R11.1
N$77
  Top 0.305: U$20.24 34.8,58.93 34.42,58.55
  Top 0.508: 34.42,58.55 34.04,58.17 34.04,54.22 34.16,54.1 C31.1
  Top 0.762: R62.1 31.59,58.68 C32.2
  Top 1.27: C32.2 29.37,58.68 R13.1 | C31.1 31.66,54.1 R62.1
N$78
  Top 0.203: U$34.16 88.25,58.04 C34.1
N$79
  Top 0.305: U$20.23 34.29,59.44 33.15,60.58
  Top 0.508: 33.15,60.58 C32.1
  Top 0.762: C39.2 C32.1
  Top 1.27: C39.2 28.86,64.64 R15.1 | C32.1 28.86,60.58 R63.1
N$80  (via drill 0.38)
  Top 0.305: U$20.22 34.67,59.94 33.91,60.71
  Top 0.508: v32.89,66.42 33.88,65.43 33.88,60.73 33.91,60.71
  Top 0.61: U$21.P$1 v39.12,64.77 | v32.89,66.42 32.77,66.55 C39.1
  Top 1.27: C39.1 29.12,66.55 R64.1
  Bottom 0.61: v39.12,64.77 34.54,64.77 v32.89,66.42
N$81
  Top 0.203: U$25.2 C41.2
N$82
  Top 0.305: U$20.19 36.6,61.44 36.2,61.85
  Top 0.508: 33.27,81.85 C40.1 33.83,81.79 35.87,79.76 35.87,62.18 36.2,61.85
  Top 0.762: R66.1 31.08,85.44 30.48,86.04
  Top 1.27: R21.1 30.48,86.04 C46.2 | R66.1 33.27,81.85 C40.1
N$83
  Top 0.305: U$20.18 37.13,61.92 36.58,62.48
  Top 0.508: 36.58,62.48 36.52,62.53 36.52,85.27 34.04,87.76 30.8,87.76 C46.1
  Top 0.762: C46.1 34.1,88.01 C47.2
  Top 1.27: R67.1 30.48,88.07 C46.1 | R23.1 32.17,93.22 C47.2
N$84
  Top 0.305: U$20.17 37.77,62.43 37.21,62.99
  Top 0.508: 37.21,62.99 37.19,63.02 37.19,93.12 35.18,95.12 C47.1 34.03,95.19
  Top 0.762: R68.1 31.85,98.9 C48.2
  Top 1.27: R68.1 34.03,95.19 C47.1 | R25.1 30.73,99.38 C48.2
N$85
  Top 0.203: 37.85,67.06 37.85,66.8 37.97,66.93
  Top 0.305: U$20.16 38.66,62.94 37.85,63.75
  Top 0.508: 30.73,101.92 C48.1 34.8,101.6 37.85,98.55 37.85,67.06 | 37.85,63.75 37.85,66.8
  Top 0.61: U$43.P$1 37.97,66.93 37.9,67.01 | 37.9,67.01 37.9,67.06 | 37.9,67.01 37.9,66.8
  Top 1.27: R69.1 30.73,101.92 C48.1
N$86
  Top 0.305: U$20.27 37.49,57.43 36.83,56.77
  Top 0.508: 36.83,56.77 36.83,38.48 35.3,36.95 C28.2
  Top 0.762: C29.2 C28.2 33.43,36.95 R59.1
  Top 1.27: C29.2 31.66,39.12 R5.1
N$97
  Top 0.305: U$20.29 38.41,56.44 38.18,56.21 38.18,44.56 39.88,42.86 39.88,38.41 C51.1 40.45,35.94 R72.1
  Top 0.61: R72.1 40.83,35.56 C53.2
N$98
  Top 0.305: U$20.28 38.06,56.95 37.59,56.48 37.59,44.18 39.24,42.53 39.24,38.54 C51.2 38.55,35.94 R71.1
  Top 0.61: R71.1 38.16,35.56 C52.1
N$99  (via drill 0.35)
  Top 0.254: R29.2 24.64,18.14 24.69,18.09
  Top 0.305: 27.81,14.73 R27.2 27.53,14.73 24.69,17.58 24.69,18.09
  Top 0.406: R73.1 50.48,30.1 C54.2
  Bottom 0.406: v34.29,27.69 34.29,29.21 35.18,30.1 R73.1
  other vias: 47.9,30.1
  pour Top (rank 2, no thermals): 37.97,27.94 25.91,27.94 25.91,-0.63 37.97,-0.63
N$100
  pour Top (no thermals): 37.97,27.94 64.64,27.94 64.64,-0.63 37.97,-0.63
N$101  (via drill 0.35)
  Top 0.762: v66.04,11.43 U$23.1 70.76,11.43 R74.2 | v64.77,22.1 64.77,30.23 61.98,33.02 50.39,33.02 R75.1 47.91,33.12 U$40.P$2
  Bottom 0.762: v66.04,11.43 64.77,12.7 v64.77,22.1
N$102
  Top 0.61: U$41.3 U$40.P$1 47.91,35.97 R75.2
N$103
  Top 0.305: U$20.2 46.56,56.44 48.39,54.61 48.39,43.18 46.74,41.53 46.74,40.26 U$41.2
N$104
  Top 0.406: C54.1 C55.2
N$105
  Top 0.305: U$20.11 46.48,60.94 | 46.48,60.94 47.73,60.94 48.07,61.28 48.05,61.29 48.05,61.47 | U$20.12 46.48,61.44 46.48,60.94 | U$20.14 46.86,62.43 47.09,62.66 47.65,62.66 48.05,62.26 48.05,61.47 | 48.05,61.47 49.72,61.47 C56.2
N$106  (via drill 0.35)
  Top 0.305: U$20.13 47.32,61.92 v47.37,61.98
  Bottom 0.305: v47.37,61.98 48.01,62.61 R76.1
N$107  (via drill 0.35)
  Top 0.305: U$20.7 47.72,58.93 v48.39,58.26
  Bottom 0.305: 49.98,58.93 50.07,59.02 | 50.07,59.02 C57.2 | v48.39,58.26 49.31,58.26 50.07,59.02
N$108
  Top 0.305: U$44.12 46.38,87.91 45.06,86.59 R84.1
  Top 0.61: U$46.1 43.43,83.82 R84.1
N$109
  Top 0.61: R85.2 39.24,85.47 40.01,84.71 U$46.3
N$110
  Top 0.203: U$57.P$4 86.78,101.44 86.68,101.54 86.42,101.54 86.38,101.49 U$57.P$5
N$112
  Top 0.305: LED12.C R79.2
N$113
  Top 0.203: U$57.P$48 U$57.P$49
N$114
  Top 0.61: U$47.P$1 41.34,87.62 R58.2 U$45.1 41.33,90.74 R85.1
N$115
  Top 0.61: R86.1 44.84,93.15 U$45.3
N$116
  Top 0.305: U$44.7 47.3,90.42 R87.1
  Top 0.61: R86.2 R87.1 46.8,89.58 C58.1
N$122
  Top 0.305: U$44.27 57.89,91.92 58.8,92.84 C60.2
N$124
  Top 0.305: R93.2 LED10.A
N$125
  Top 0.305: R94.2 LED11.A
N$126
  Top 0.305: R95.2 LED13.A
N$127
  Top 0.305: R96.2 LED14.A
N$128
  Top 0.305: R97.2 LED15.A
N$129
  Top 0.203: U$44.16 54.7,86.41 52.68,88.43 52.68,95.66 51.67,96.67 51.67,97.19 LED10.C
N$130
  Top 0.203: U$44.17 54.69,86.92 53.04,88.58 53.04,95.81 52.32,96.52 LED11.C
N$131
  Top 0.203: U$44.18 54.69,87.43 53.39,88.72 53.39,96.18 53.47,96.26 LED13.C
N$132
  Top 0.203: U$44.19 54.71,87.91 53.75,88.88 53.75,96.03 54.21,96.5 54.46,96.5 54.61,96.65 LED14.C
N$133
  Top 0.203: LED15.C 55.75,96.9 54.2,95.35 54.2,88.99 54.77,88.42 U$44.20
N$134
  Top 0.305: R98.2 LED16.A
N$135
  Top 0.203: R99.2 49.15,85.61 49.15,86.49 49.58,86.92 U$44.14
  Top 0.61: R99.2 50.06,84.75 S2.P$1
N$136  (via drill 0.35)
  Top 0.203: LED16.C 50.04,97.03 50.42,96.65 51.18,96.65 52.13,95.69 52.2,95.63 52.2,94.64 v52.05,94.49 | v51.69,86.11 51.44,86.11 51.13,86.41 U$44.15
  Bottom 0.203: v52.05,94.49 52.05,91.34 52.2,91.19 52.2,86.61 v51.69,86.11
N$138  (via drill 0.35)
  Top 0.305: U$44.11 51.54,88.42 52.96,87 52.96,80.09 v53.51,79.54 | v53.98,76.07 54.1,75.95 R101.1
  Bottom 0.305: v53.51,79.54 53.51,76.54 v53.98,76.07
N$139
  Top 0.305: U$44.13 51.64,87.43 52.45,86.61 52.45,79.63 53.59,78.49 R100.1
N$140
  Top 0.61: R100.2 58.51,78.33 R104.1 60.73,78.49 R102.1 63.12,78.8 U$50.2
N$141
  Top 0.61: U$51.2 62.48,75.63 R103.1 62.65,76.1 R105.1 58.51,76.1 R101.2
N$142
  Top 0.61: U$54.2 R106.1 | R106.1 | U$55.P$1 55.32,63.63 54.04,63.63 R106.1
N$143
  Top 0.61: R111.2 51.93,66.71 U$54.3
N$144  (via drill 0.35)
  Top 0.762: U$22.1 37.08,16.51 v37.34,16.76 | v38.1,23.88 44.32,30.1 R73.2 45.06,33.61 R22.1
  Bottom 0.762: v37.34,16.76 38.1,17.53 v38.1,23.88
N$145
  Top 0.305: S1.P$3 69.76,91.15 69.47,91.44 69.47,94.46 R107.2 70,97.13 69.47,97.66 69.47,99.82 69.85,100.2 69.86,100.2 J1.1
N$146
  Top 0.762: C63.1 C62.2
N$147
  Top 0.305: R108.2
  Top 0.61: U$54.1 R108.2
PACK+  (via drill 0.35)
  Top 0.152: U$60.2 12,8.38 v11.94,8.38
  Top 0.813: U$56.P$1 80.58,10.86 C63.2 84.39,8.38 v88.77,8.38
  other vias: 10.67,8.38 13.21,8.38 90.04,8.38 87.5,8.38
  pour Top (no thermals): 9.27,11.18 14.48,11.18 14.48,7.87 9.27,7.87
  pour Top (no thermals): 86.23,10.8 91.31,10.8 91.31,7.62 86.23,7.62
  pour Bottom (no thermals): -0.76,-0.63 102.74,-0.63 102.74,27.94 -1.4,27.94 -1.4,-0.63
PACK-  (via drill 0.35)
  Top 0.406: C55.1 62.74,29.97 v62.74,29.84 | v67.82,29.21 67.82,26.67
  Bottom 0.406: v62.74,29.84 67.18,29.84 v67.82,29.21
  pour Top (rank 2, no thermals): 64.64,-0.63 102.11,-0.63 102.11,27.94 64.64,27.94
REGOUT  (via drill 0.35)
  Top 0.305: U$44.26 59.92,91.42 v60.07,91.57 60.96,92.46 60.96,93.98 | 60.96,93.98 C59.2 | 48.64,59.05 48.26,59.44 U$20.8 | C68.2 | R84.2 48.3,83.42 R99.1 50.04,82.17 v50.42,81.79 | R92.1 68.51,83.75 68.07,83.31 v65.28,83.31 | R98.1 48.78,102.25 v48.77,102.23 | R26.1 57.28,99.06 58.04,98.3 62.61,98.3 63.37,97.54 63.37,94.74 62.61,93.98 60.96,93.98 | 55.75,59.37 55.75,50.8 54.86,49.91 v52.07,49.91
  Top 0.508: 48.64,59.05 51.76,59.05 C68.2
  Top 0.61: C68.2 55.75,59.37 60.39,59.37 62.87,61.85 v62.87,69.47 | v70.99,71.76 R3.2
  Bottom 0.305: R81.1 C68.2 | R82.1 v52.07,49.91 | v50.42,81.79 62.48,81.79 62.87,81.41 | v65.28,83.31 62.87,83.31 | v48.77,102.23 55.99,102.23 R26.1
  Bottom 0.61: v60.07,91.57 62.87,88.77 62.87,83.31 62.87,81.41 v62.87,69.47 68.71,69.47 v70.99,71.76
  other vias: 52.07,59.37 57.28,100.95
REGSRC
  Top 0.305: U$20.9 48.57,59.94 48.8,59.71
  Top 0.508: 48.8,59.71 51.31,59.71 51.75,60.16 53.55,60.16 53.98,60.58 R106.2
  Top 0.61: R106.2 55.26,61.66 U$55.P$2 57.16,61.04 C61.2
SCL  (via drill 0.35)
  Top 0.203: 87.25,91.97 89.17,91.97 91.03,93.83 91.03,95.89 90.45,96.48 90.05,96.48 U$57.P$38 | 87.25,91.97 | 87.25,91.97 87.25,91.24 R78.2 | 87.25,91.97 85.62,91.97 85.28,91.63 | 85.28,91.63 85.22,91.57 | 85.28,91.63 78.49,84.84 v78.49,79.76 78.36,79.63 78.36,66.29 81.41,63.25 91.31,63.25 v93.41,61.15 94.11,60.45 94.11,52.96 92.55,51.41 U$25.8 86.1,54.45 U$34.11 | v72.52,78.23 R1.2 | JP5.2 82.3,77.98 v80.77,79.5 | J3.3 v95.25,62.36
  Bottom 0.203: v72.52,78.23 76.96,78.23 v78.49,79.76 80.52,79.76 v80.77,79.5 | v95.25,62.36 94.61,62.36 v93.41,61.15
SDA  (via drill 0.35)
  Top 0.203: U$57.P$37 90.05,96.08 90.35,96.08 90.68,95.74 90.68,93.98 89.03,92.33 87.25,92.33 | 87.25,92.33 87.12,92.46 R77.2 | 87.25,92.33 85.09,92.33 77.72,84.96 v77.72,81.92 77.72,80.9 73.02,76.2 R2.2 | JP5.3 81.03,80.52 v79.63,81.92 79.63,66.55 82.04,64.14 91.95,64.14 95,61.09 95,59.31 | U$25.7 v90.42,50.16 92.57,50.16 95,52.58 95,59.31 | v86.99,54.99 86.99,55.24 86.6,55.64 U$34.12 | J3.2 96.9,59.31 95,59.31
  Bottom 0.203: v79.63,81.92 v77.72,81.92 | v90.42,50.16 90.42,50.04 86.99,53.47 v86.99,54.99
SMBC
  Top 0.61: R102.2 65.8,78.49 66.08,78.21 66.8,78.21 | 66.8,78.21 69.17,78.21 R1.1 | U$53.P$2 66.8,78.36 66.8,78.21
SMBD
  Top 0.61: R103.2 65.8,75.95 66.08,76.23 66.93,76.23 | 66.93,76.23 69.17,76.23 R2.1 | U$52.P$2 66.93,76.23
UART_RX  (via drill 0.35)
  Top 0.203: U$57.P$15 83.13,98.5 v82.8,98.17
  Bottom 0.203: v82.8,98.17 82.8,72.64 85.47,69.98 J3.6
UART_TX  (via drill 0.35)
  Top 0.203: v81.91,98.56 82.25,98.9 U$57.P$14
  Bottom 0.203: J3.5 95.22,69.62 85.32,69.62 81.91,73.04 81.91,91.17 81.91,91.18 81.91,91.7 81.91,91.71 v81.91,98.56
VC5X  (via drill 0.35)
  Top 0.305: U$21.P$2 43.43,63.96 43.43,60.96 43.97,60.43 U$20.10 50.84,60.43 R108.1 51.81,61.66 C56.1 v49.91,64.77
  Top 0.61: R109.1 46.23,72.14 C67.2 C64.1 | R109.1 43.33,68.48 42.8,67.95 42.8,66.22 U$21.P$2 | C49.1 32.38,70.61 v32.89,71.12 | v42.42,73.66 43.05,73.66 43.33,73.38 R109.1
  Top 1.27: C50.2 C49.1
  Bottom 0.305: 50.42,62.67 R76.2 50.48,64.2 v49.91,64.77
  Bottom 0.61: v32.89,71.12 35.43,71.12 37.97,73.66 v42.42,73.66
VC10X
  Top 0.305: U$20.15 46.05,62.94 46.67,63.56 47.5,64.39 47.5,66.29 46.86,66.93 U$43.P$2
  Top 0.61: R110.1 43.46,77.98 C64.2 47.37,77.98 48.51,76.84 48.51,70.57 48.49,70.55 48.49,67.29 47.5,66.29
VESC_ADC_CONTROL_A
  Top 0.406: U$5.4 91.47,67.69 92.04,67.69 U$5.1 93.15,67.76 96.01,64.9 J3.4

## Text on the board
tPlace: External Boot | Boot Switch | Gauge Reset | Pack Display | Cells 6-10 | SMBus Connect | SDA | SCL | GND | MCU Power | GND | RX | ADC_A | Sensor Power | SCL | SDA | GND | BMS Side | MCU Side | Cells 1-5 | 10S BMS w/ External Balancing | BQ76930 AFE w/ BQ78350-R1 Fuel Gauge | Charles Hood | August 2018 | _ | _ | + | Pack Output | Battery Input | +